# Altium schematic sheet Схема блока Sensors.SchDoc
size 420 x 297 mm; Address1: Address1; Address2: Address2; Address3: Address3; Address4: Address4; DocumentNumber: АБВГ.123456.001 Э3; SheetNumber: 1; Scale: 1:1; DocumentType: Схема электрическая принципиальная; FirstReferrence: АБВГ.123456.001
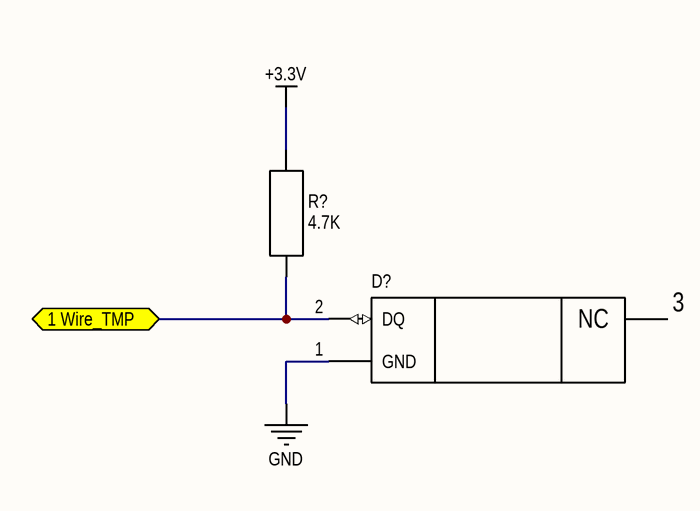
[diagram p0: Схема блока Sensors.SchDoc]

## Parts
D?  MAX31820PAR  [TO-92-3]  (value not drawn)
R?  4.7K  [CH0603R]

## Ports
1 Wire_TMP (bidir)

## Nets
+3.3V: R?.2
GND: D?.1(GND)
1 Wire_TMP: D?.2(DQ) R?.1 ; port 1 Wire_TMP

Not connected (* = marked no-connect by the designer): D? 3(NC)

## Notes on the sheet
- Подп. и дата
- Инв. № дубл.
- Взам. инв. №
- Инв. № подл.
- Изм.
- Лист
- № докум.
- Подп.
- Дата
- 2.106-A3
- Копировал
- Формат А3

## Library data of the parts
D? = MAX31820PAR: Temp sensor 1Wire; Manufacturer: Analog Devices; Model: AD22105ARZ; ComponentKind: 8-SOIC; HelpURL: https://www.digikey.com/product-detail/en/analog-devices-inc/AD22105ARZ/AD22105ARZ-ND/617049
R? = Resistor: ComponentKind: 0603 (1608 Metric); Value: 4.7K